# EAGLE schematic v001 (EAGLE 6.4)
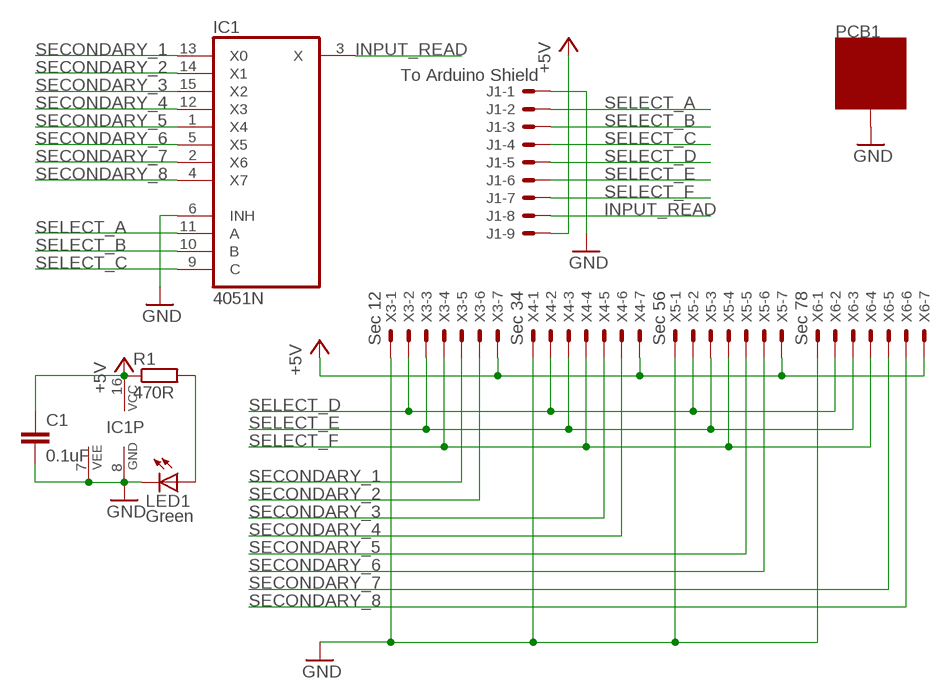
[diagram p0: schematic, sheet 1]

## Parts
C1  0.1uF  C-EU050-024X044  [C050-024X044]
IC1  4051N  [DIL16]
J1  To Arduino Shield  22-27-2091-09  [6410-09]
LED1  Green  LED3MM  [LED3MM]
PCB1  ZZZ_MODULE05X05  [ZZZ_MODULE_05X05]
R1  470R  R-EU_0204/7  [0204/7]
X3  Sec 12  22-27-2071-07  [6410-07]
X4  Sec 34  22-27-2071-07  [6410-07]
X5  Sec 56  22-27-2071-07  [6410-07]
X6  Sec 78  22-27-2071-07  [6410-07]

## Nets
+5V: C1.1 IC1.16(VCC) J1.9 R1.1 X3.7 X4.7 X5.7 X6.7
GND: C1.2 IC1.6(INH) IC1.7(VEE) IC1.8(GND) J1.1 LED1.K(C) PCB1.GND@1(GND) PCB1.GND@2(GND) PCB1.GND@3(GND) PCB1.GND@4(GND) PCB1.GND@5(GND) PCB1.GND@6(GND) PCB1.GND@7(GND) PCB1.GND@8(GND) X3.1 X4.1 X5.1 X6.1
INPUT_READ: IC1.3(X) J1.8
N$1: LED1.A R1.2
SECONDARY_1: IC1.13(X0) X3.5
SECONDARY_2: IC1.14(X1) X3.6
SECONDARY_3: IC1.15(X2) X4.5
SECONDARY_4: IC1.12(X3) X4.6
SECONDARY_5: IC1.1(X4) X5.5
SECONDARY_6: IC1.5(X5) X5.6
SECONDARY_7: IC1.2(X6) X6.5
SECONDARY_8: IC1.4(X7) X6.6
SELECT_A: IC1.11(A) J1.2
SELECT_B: IC1.10(B) J1.3
SELECT_C: IC1.9(C) J1.4
SELECT_D: J1.5 X3.2 X4.2 X5.2 X6.2
SELECT_E: J1.6 X3.3 X4.3 X5.3 X6.3
SELECT_F: J1.7 X3.4 X4.4 X5.4 X6.4

## Library data of the parts
C1 = rcl:C-EU: CAPACITOR, European symbol
IC1 = 40xx:4051: 8-channel ANALOG MULTIPLEXER
J1 = con-molex:22-?-09: CONNECTOR wire to board 2.54 mm (.1 inch) pitch header; OC_FARNELL: unknown; OC_NEWARK: unknown
LED1 = led:LED: LED OSRAM: - CHIPLED LG R971, LG N971, LY N971, LG Q971, LY Q971, LO R971, LY R971 LH N974, LH R974 LS Q976, LO Q976, LY Q976 LO Q996 - Hyper CHIPLED LW Q18S LB Q993, LB Q99A, LB R99A - SideLED LS A670, LO A670, LY A670, LG A670, LP A670 LB A673, LV A673, LT A673, LW A673 LH A674 LY A675 LS A676, LA A676, LO A676, LY A676, LW A676 LS A679, LY A679, LG A679 - Hyper Micro SIDELED® LS Y876, LA Y876, LO Y876, LY Y876 LT Y87S - SmartLED LW L88C, LW L88S LB L89C, LB L89S, LG L890 LS L89K, LO L89K, LY L89K LS L896, LA L896, LO L896, LY L896 - TOPLED LS T670, LO T670, LY T670, LG T670, LP T670 LSG T670, LSP T670, LSY T670, LOP T670, LYG T670 LG T671, LOG T671, LSG T671 LB T673, LV T673, LT T673, LW T673 LH T674 LS T676, LA T676, LO T676, LY T676, LB T676, LH T676, LSB T676, LW T676 LB T67C, LV T67C, LT T67C, LS T67K, LO T67K, LY T67K, LW E67C LS E67B, LA E67B, LO E67B, LY E67B, LB E67C, LV E67C, LT E67C LW T67C LS T679, LY T679, LG T679 LS T770, LO T770, LY T770, LG T770, LP T770 LB T773, LV T773, LT T773, LW T773 LH T774 LS E675, LA E675, LY E675, LS T675 LS T776, LA T776, LO T776, LY T776, LB T776 LHGB T686 LT T68C, LB T68C - Hyper Mini TOPLED® LB M676 - Mini TOPLED Santana® LG M470 LS M47K, LO M47K, LY M47K Source: http://www.osram.convergy.de LUXEON: - LUMILED® LXK2-PW12-R00, LXK2-PW12-S00, LXK2-PW14-U00, LXK2-PW14-V00 LXK2-PM12-R00, LXK2-PM12-S00, LXK2-PM14-U00 LXK2-PE12-Q00, LXK2-PE12-R00, LXK2-PE12-S00, LXK2-PE14-T00, LXK2-PE14-U00 LXK2-PB12-K00, LXK2-PB12-L00, LXK2-PB12-M00, LXK2-PB14-N00, LXK2-PB14-P00, LXK2-PB14-Q00 LXK2-PR12-L00, LXK2-PR12-M00, LXK2-PR14-Q00, LXK2-PR14-R00 LXK2-PD12-Q00, LXK2-PD12-R00, LXK2-PD12-S00 LXK2-PH12-R00, LXK2-PH12-S00 LXK2-PL12-P00, LXK2-PL12-Q00, LXK2-PL12-R00 Source: www.luxeon.com KINGBRIGHT: KA-3528ASYC Source: www.kingbright.com
PCB1 = GNLib:ZZZ_MODULE
R1 = rcl:R-EU_: RESISTOR, European symbol
X3-X6 = con-molex:22-?-07: CONNECTOR wire to board 2.54 mm (.1 inch) pitch header; OC_FARNELL: unknown; OC_NEWARK: unknown